# EasyEDA Pro project 电源板.epro

# Schematic Schematic1
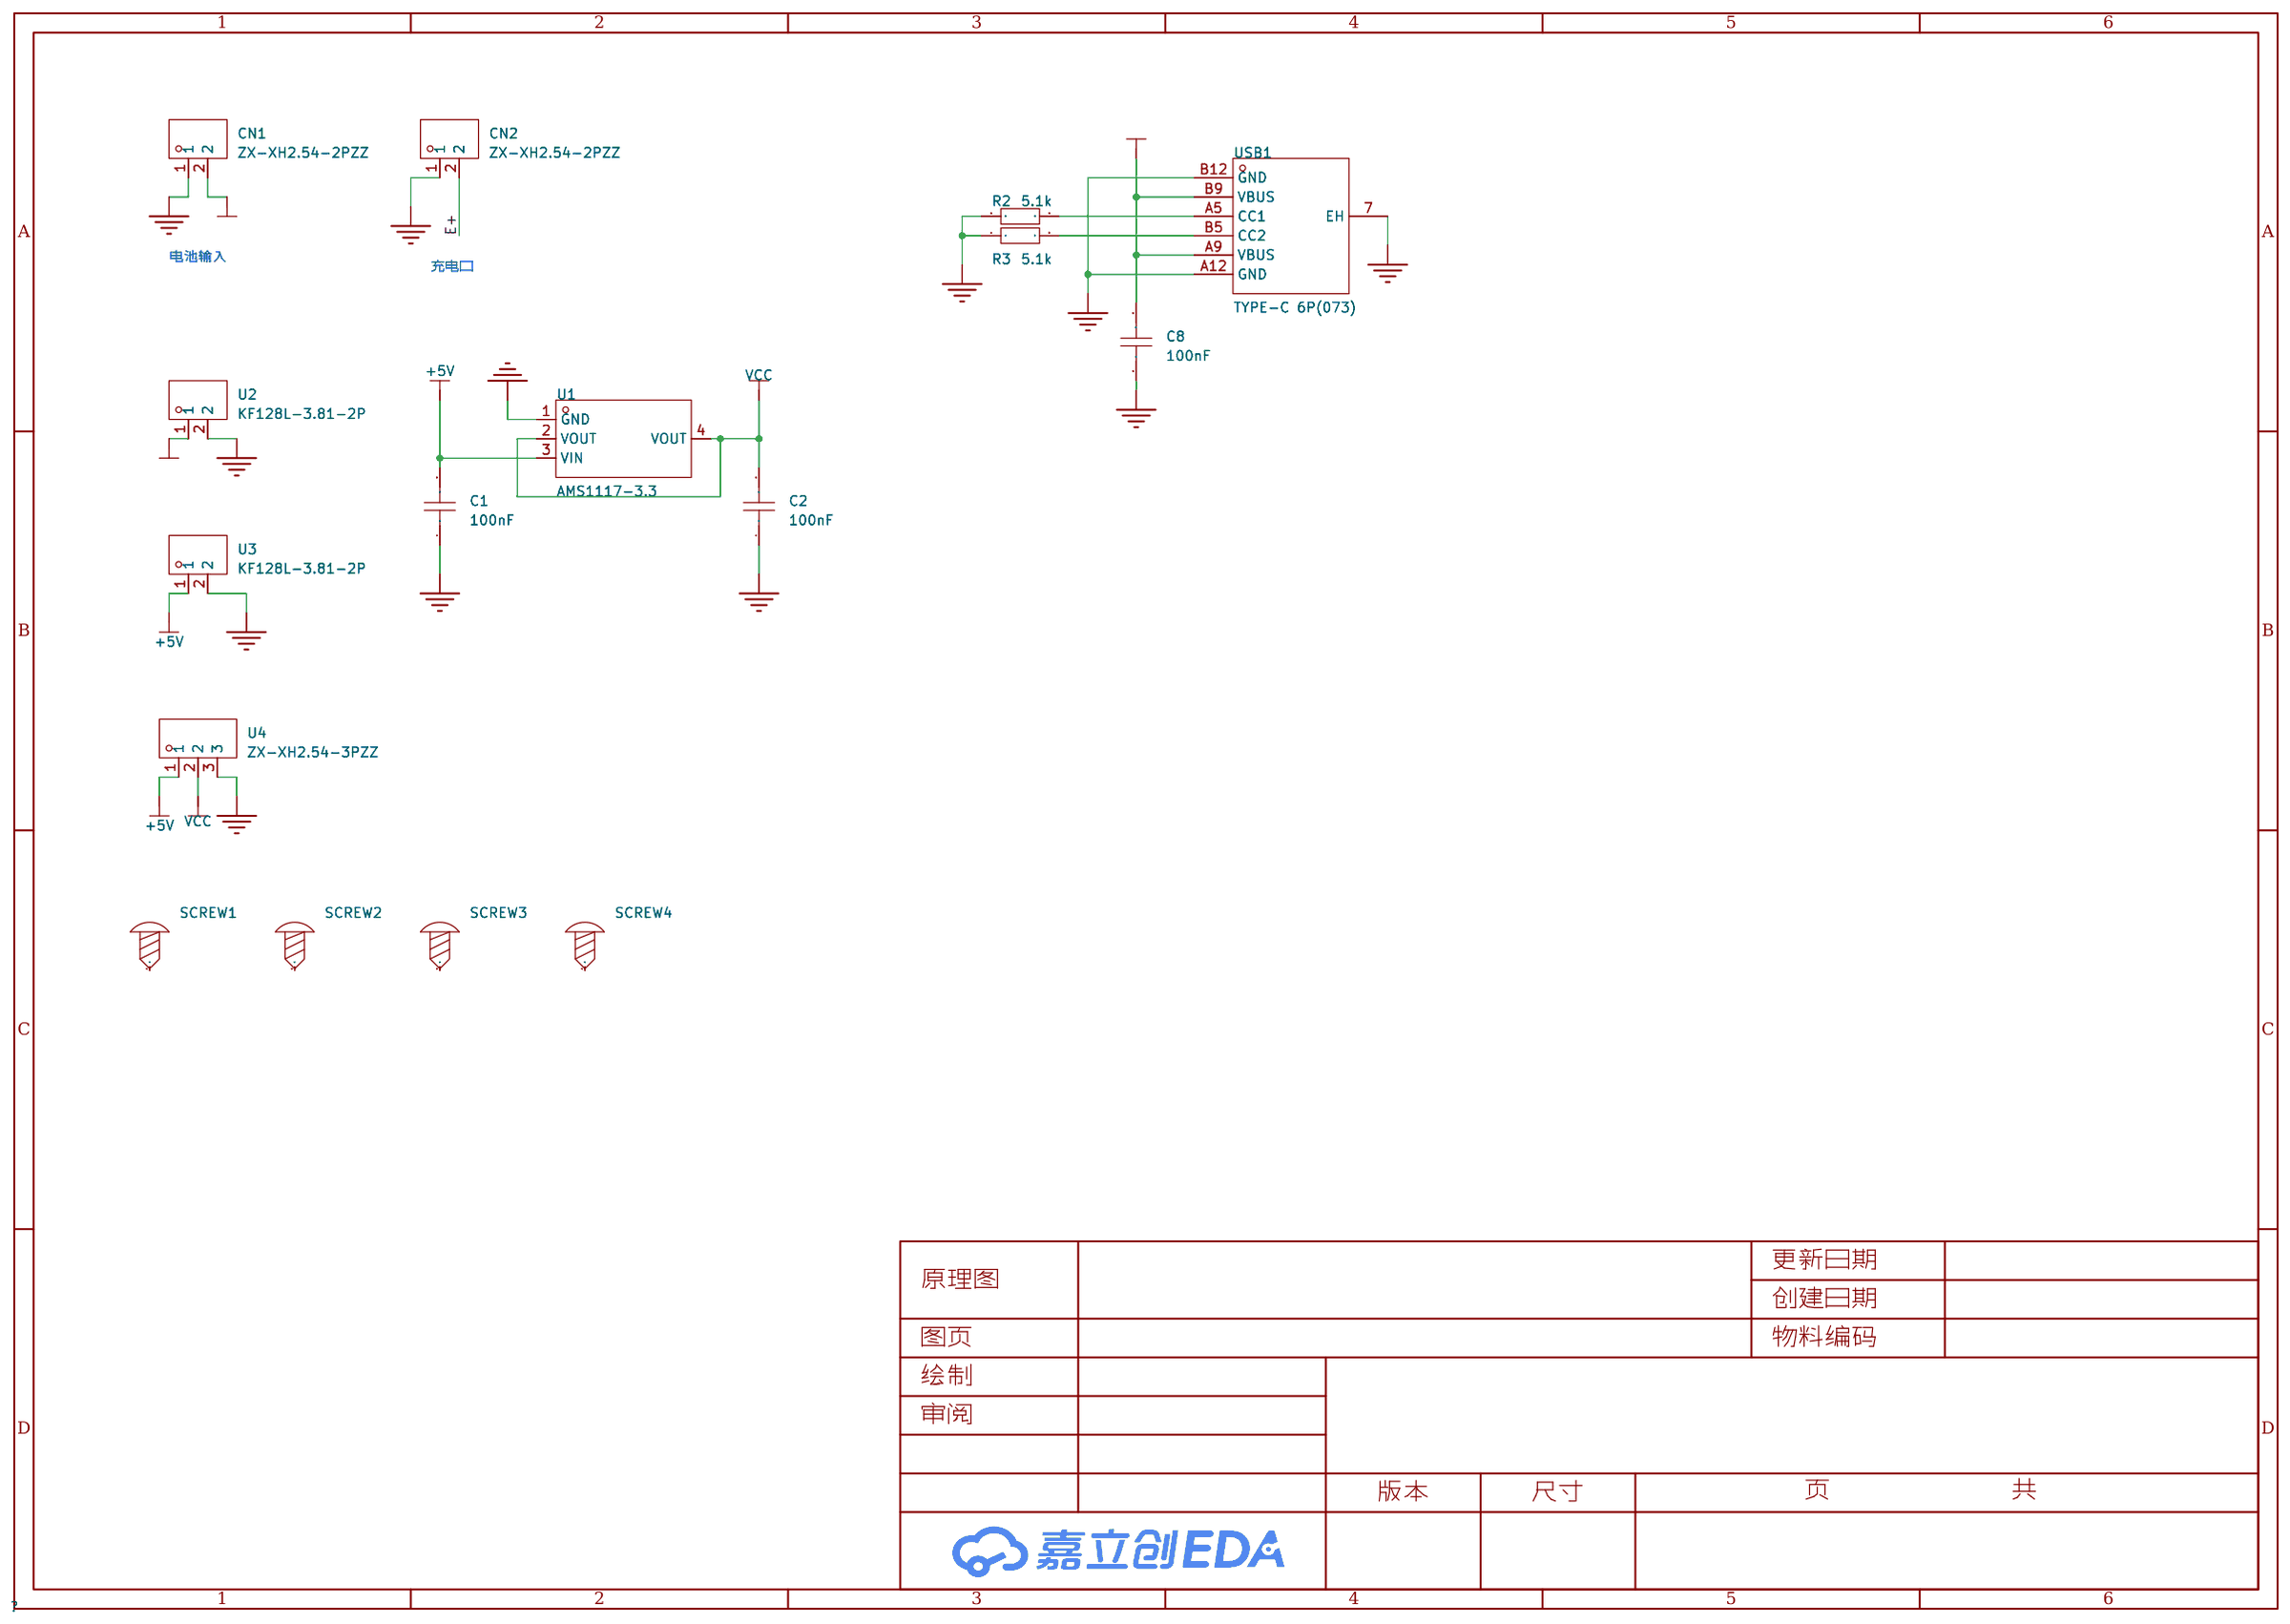
[diagram p0: schematic sheet]

## Parts
C1  100nF  [C0603]
C2  100nF  [C0603]
C8  100nF  [C0603]
CN1  ZX-XH2.54-2PZZ  [CONN-TH_2P-P2.50_HX25003-2A]
CN2  ZX-XH2.54-2PZZ  [CONN-TH_2P-P2.50_HX25003-2A]
R2  5.1k  [R0603]
R3  5.1k  [R0603]
SCREW1  -  [M3螺丝]
SCREW2  -  [M3螺丝]
SCREW3  -  [M3螺丝]
SCREW4  -  [M3螺丝]
U1  AMS1117-3.3  [SOT-223-3_L6.5-W3.4-P2.30-LS7.0-BR]
U2  KF128L-3.81-2P  [CONN-TH_P3.81_KF128L-3.81-2P]
U3  KF128L-3.81-2P  [CONN-TH_P3.81_KF128L-3.81-2P]
U4  ZX-XH2.54-3PZZ  [CONN-TH_3P-P2.54_2501S-3P]
USB1  TYPE-C 6P(073)  [TYPE-C-SMD_TYPE-C-6P_5]

## Library data of the parts
C1 C2 C8 = CAP_0603: Supplier Footprint: 0603
CN1 CN2 = ZX-XH2.54-2PZZ: 插针结构:1x2P;间距:2.54mm;安装方式:直插;参考系列:XH;总PIN数:2P;排数:1;每排PIN数:2;行距:-;额定电流:3A;触头材质:黄铜;触头镀层:锡;工作温度范围:-25℃~+85℃;; Supplier Part: C7429632; Manufacturer: Megastar(兆星); Supplier Footprint: 插件,P=2.54mm; JLCPCB Part Class: 扩展库; Datasheet: https://atta.szlcsc.com/upload/public/pdf/source/20230619/19BA6947230AA44A04D3EDD65E618FD0.pdf; Supplier: LCSC; Pins Structure: 1x2P; Pitch: 2.54mm; Mounting Style: 直插; Reference Series: XH; Number of Pins: 2P; Number of Rows: 1; Number of PINs Per Row: 2; Current Rating (Max): 3A; Contact Material: 黄铜; Contact Plating: 锡; Operating Temperature Range: -25℃~+85℃
R2 R3 = Res_0603: Supplier Footprint: 0603
SCREW1-SCREW4 = M3螺丝: Supplier Footprint: 插件
U1 = AMS1117-3.3_C6186: 输出类型:固定;最大输入电压:-;输出电压:3.3V;最大输出电流:1A;电源纹波抑制比(PSRR):72dB@(120Hz);输出极性:正极;; LCSC Part Name: 输出3.3V 1A; Supplier Part: C6186; Manufacturer: AMS; Supplier Footprint: SOT-223; JLCPCB Part Class: 基础库; Datasheet: https://atta.szlcsc.com/upload/public/pdf/source/20180727/C6186_7A095716F0823C02F1997A905E26C086.pdf; Supplier: LCSC; Output Type: 固定; Output Voltage: 3.3V; MAX Output Current: 1A; Power Supply Rejection Ratio (PSRR): 72dB@(120Hz); Dropout Voltage: 1.3V@(800mA); Output Polarity: 正极; Number of Outputs: 1
U2 U3 = KF128L-3.81-2P: 结构:1x2P;间距:3.81mm;颜色:绿色;安装方式:直插;额定电流:10A;额定电压:300V;排数:1;线规 - AWG:16~26;线规 - 平方毫米:1;每排PIN数:2;工作温度范围:-40℃~+105℃;; LCSC Part Name: 3.81mm 1x2P 排数:1 每排P数:2 直插; Supplier Part: C474932; Manufacturer: KEFA(科发); Supplier Footprint: 插件,P=3.81mm; JLCPCB Part Class: 扩展库; Datasheet: https://atta.szlcsc.com/upload/public/pdf/source/20240118/B0177BAB216696F90B0D16B51EF273F7.pdf; Supplier: LCSC; Structure: 1x2P; Pitch: 3.81mm; Color: 绿色; Mounting Style: 直插; Current Rating (Max): 10A; Voltage Rating (Max): 300V; Number of Pins: 2P; Number of Rows: 1; Wire Gauge - AWG: 16~26; Wire Gauge - mm2: 1; Number of PINs Per Row: 2; Operating Temperature Range: -40℃~+105℃
U4 = ZX-XH2.54-3PZZ: 插针结构:1x3P;间距:2.54mm;安装方式:直插;参考系列:XH;总PIN数:3P;排数:1;每排PIN数:3;行距:-;额定电流:3A;触头材质:黄铜;触头镀层:锡;工作温度范围:-25℃~+85℃;; Supplier Part: C7429633; Manufacturer: Megastar(兆星); Supplier Footprint: 插件,P=2.54mm; JLCPCB Part Class: 扩展库; Datasheet: https://atta.szlcsc.com/upload/public/pdf/source/20230619/AE17037A2CFDBE8D9CBA775D61AD0A84.pdf; Supplier: LCSC; Pins Structure: 1x3P; Pitch: 2.54mm; Mounting Style: 直插; Reference Series: XH; Number of Pins: 3P; Number of Rows: 1; Number of PINs Per Row: 3; Current Rating (Max): 3A; Contact Material: 黄铜; Contact Plating: 锡; Operating Temperature Range: -25℃~+85℃
USB1 = TYPE-C 6P(073): 连接器类型:Type-C;标准:-;公母:母;端口数量:1;触点数量:6P;安装方式:卧贴;额定电流 - 电源:5A;工作温度范围:-25℃~+85℃;; LCSC Part Name: Type-C 母 卧贴; Supplier Part: C668623; Manufacturer: SHOU HAN(首韩); Supplier Footprint: SMD; JLCPCB Part Class: 扩展库; Datasheet: https://atta.szlcsc.com/upload/public/pdf/source/20200618/C668623_A4B260DED7AC1949BAC6AE39E9F4CD80.pdf; Supplier: LCSC; Connector Type: Type-C; Gender: 母; Number of Ports: 1; Number of Contacts: 6P; Mounting Style: 卧贴; Current Rating - Power (Max): 5A; Operating Temperature Range: -25℃~+85℃

## Nets
+5V: C1.2 U1.3(VIN) U3.1 U4.1
+7.4V: CN1.2 U2.1
GND: C1.1 C2.1 C8.1 CN1.1 CN2.1 R2.1 R3.1 U1.1(GND) U2.2 U3.2 U4.3 USB1.7(EH) USB1.A12(GND) USB1.B12(GND)
VCC: C2.2 U1.2(VOUT) U1.4(VOUT) U4.2
E+: C8.2 CN2.2 USB1.A9(VBUS) USB1.B9(VBUS)
$1N2605: R3.2 USB1.B5(CC2)
$1N2608: R2.2 USB1.A5(CC1)

Not connected (* = marked no-connect by the designer): SCREW1 1; SCREW2 1; SCREW3 1; SCREW4 1

## Notes on the sheet
- 电池输入
- 充电口

# Board PCB1
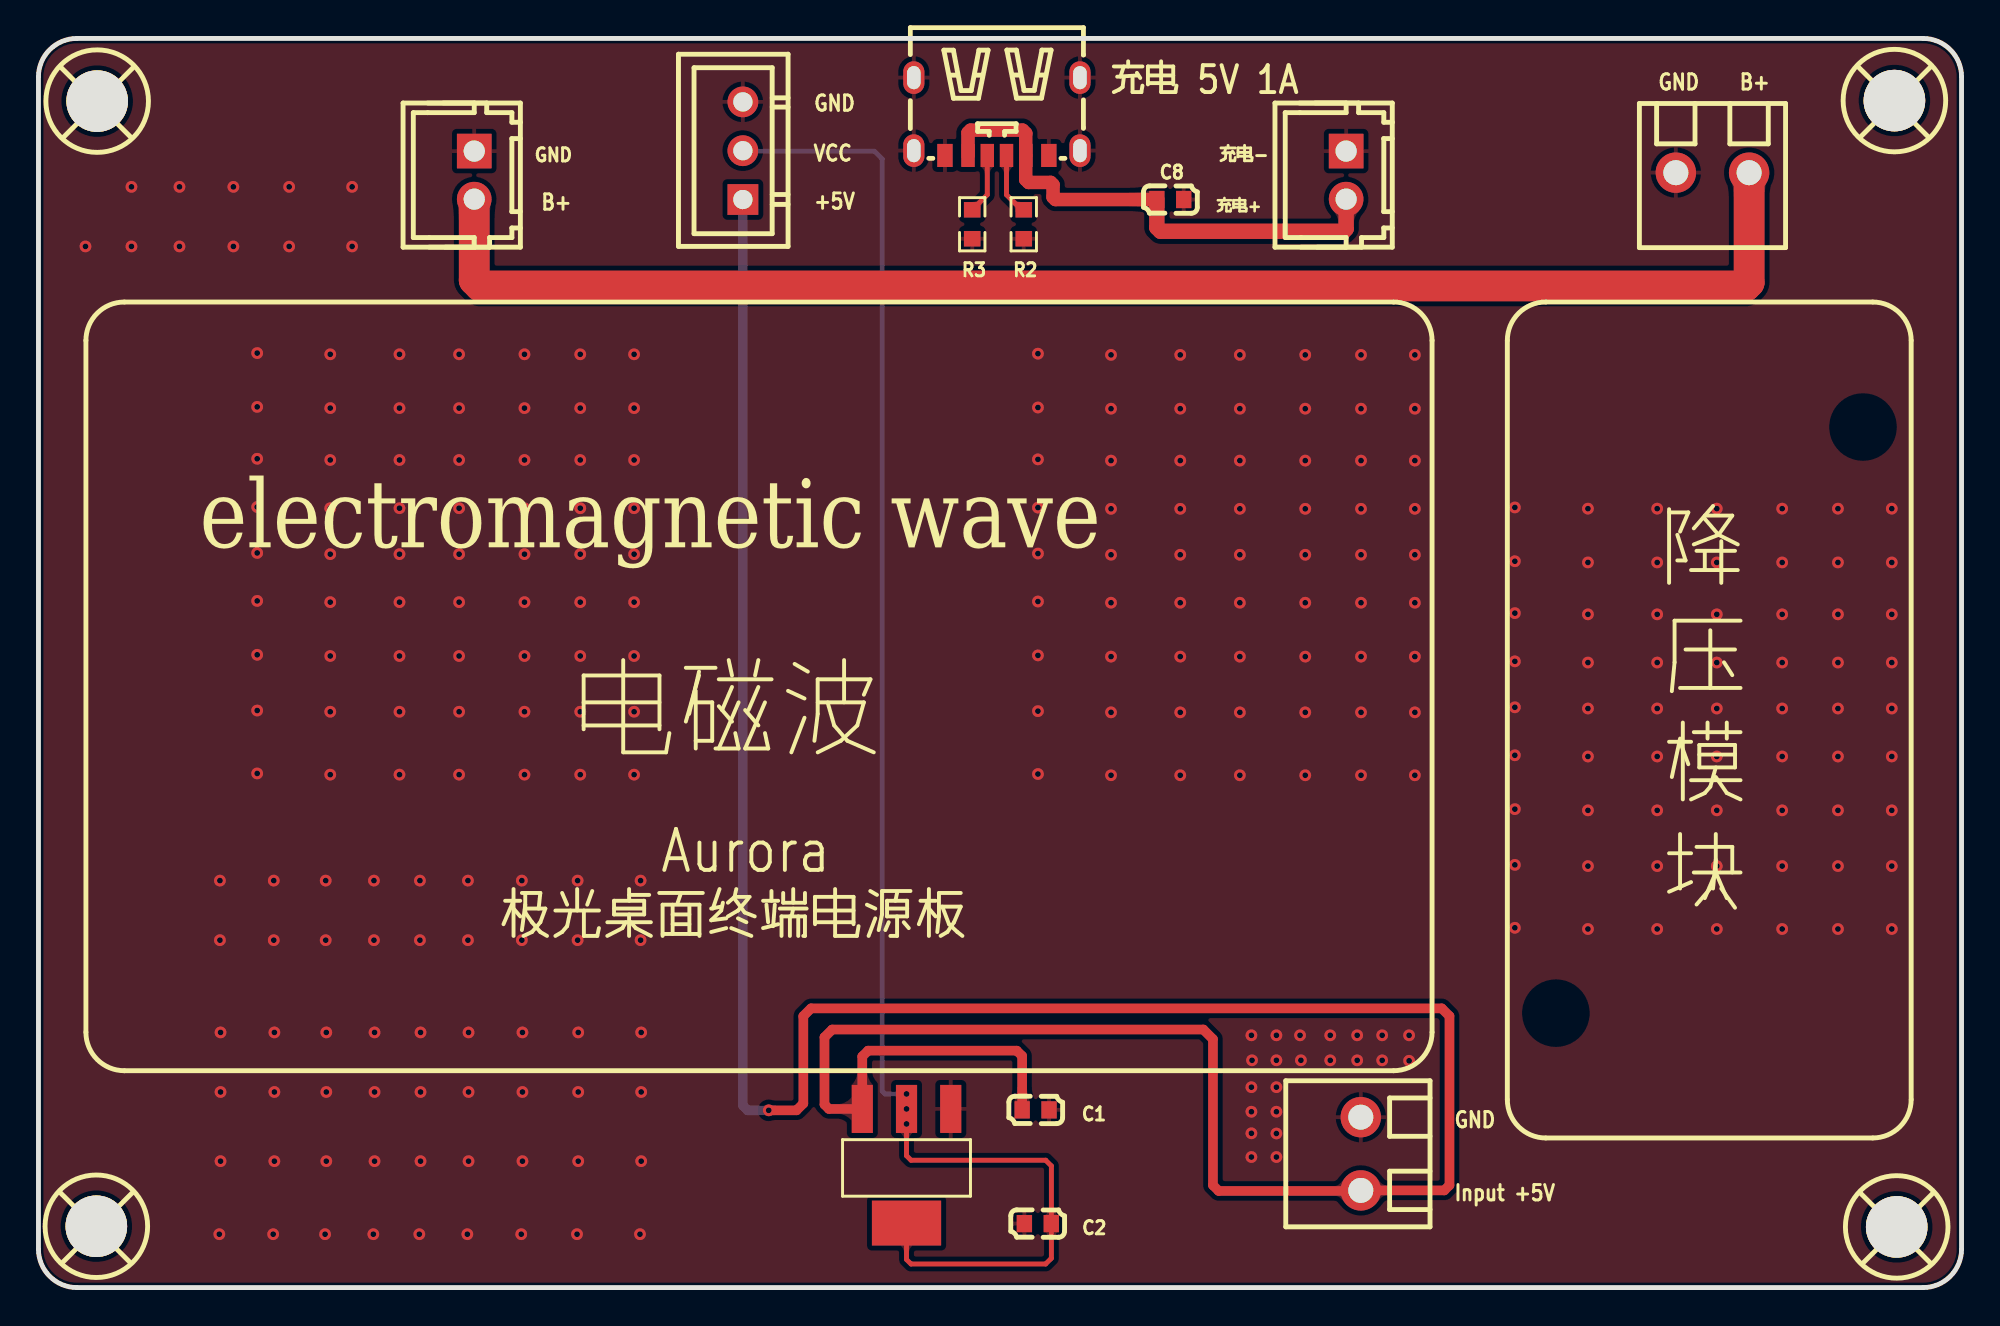
[diagram p1: board, top side]
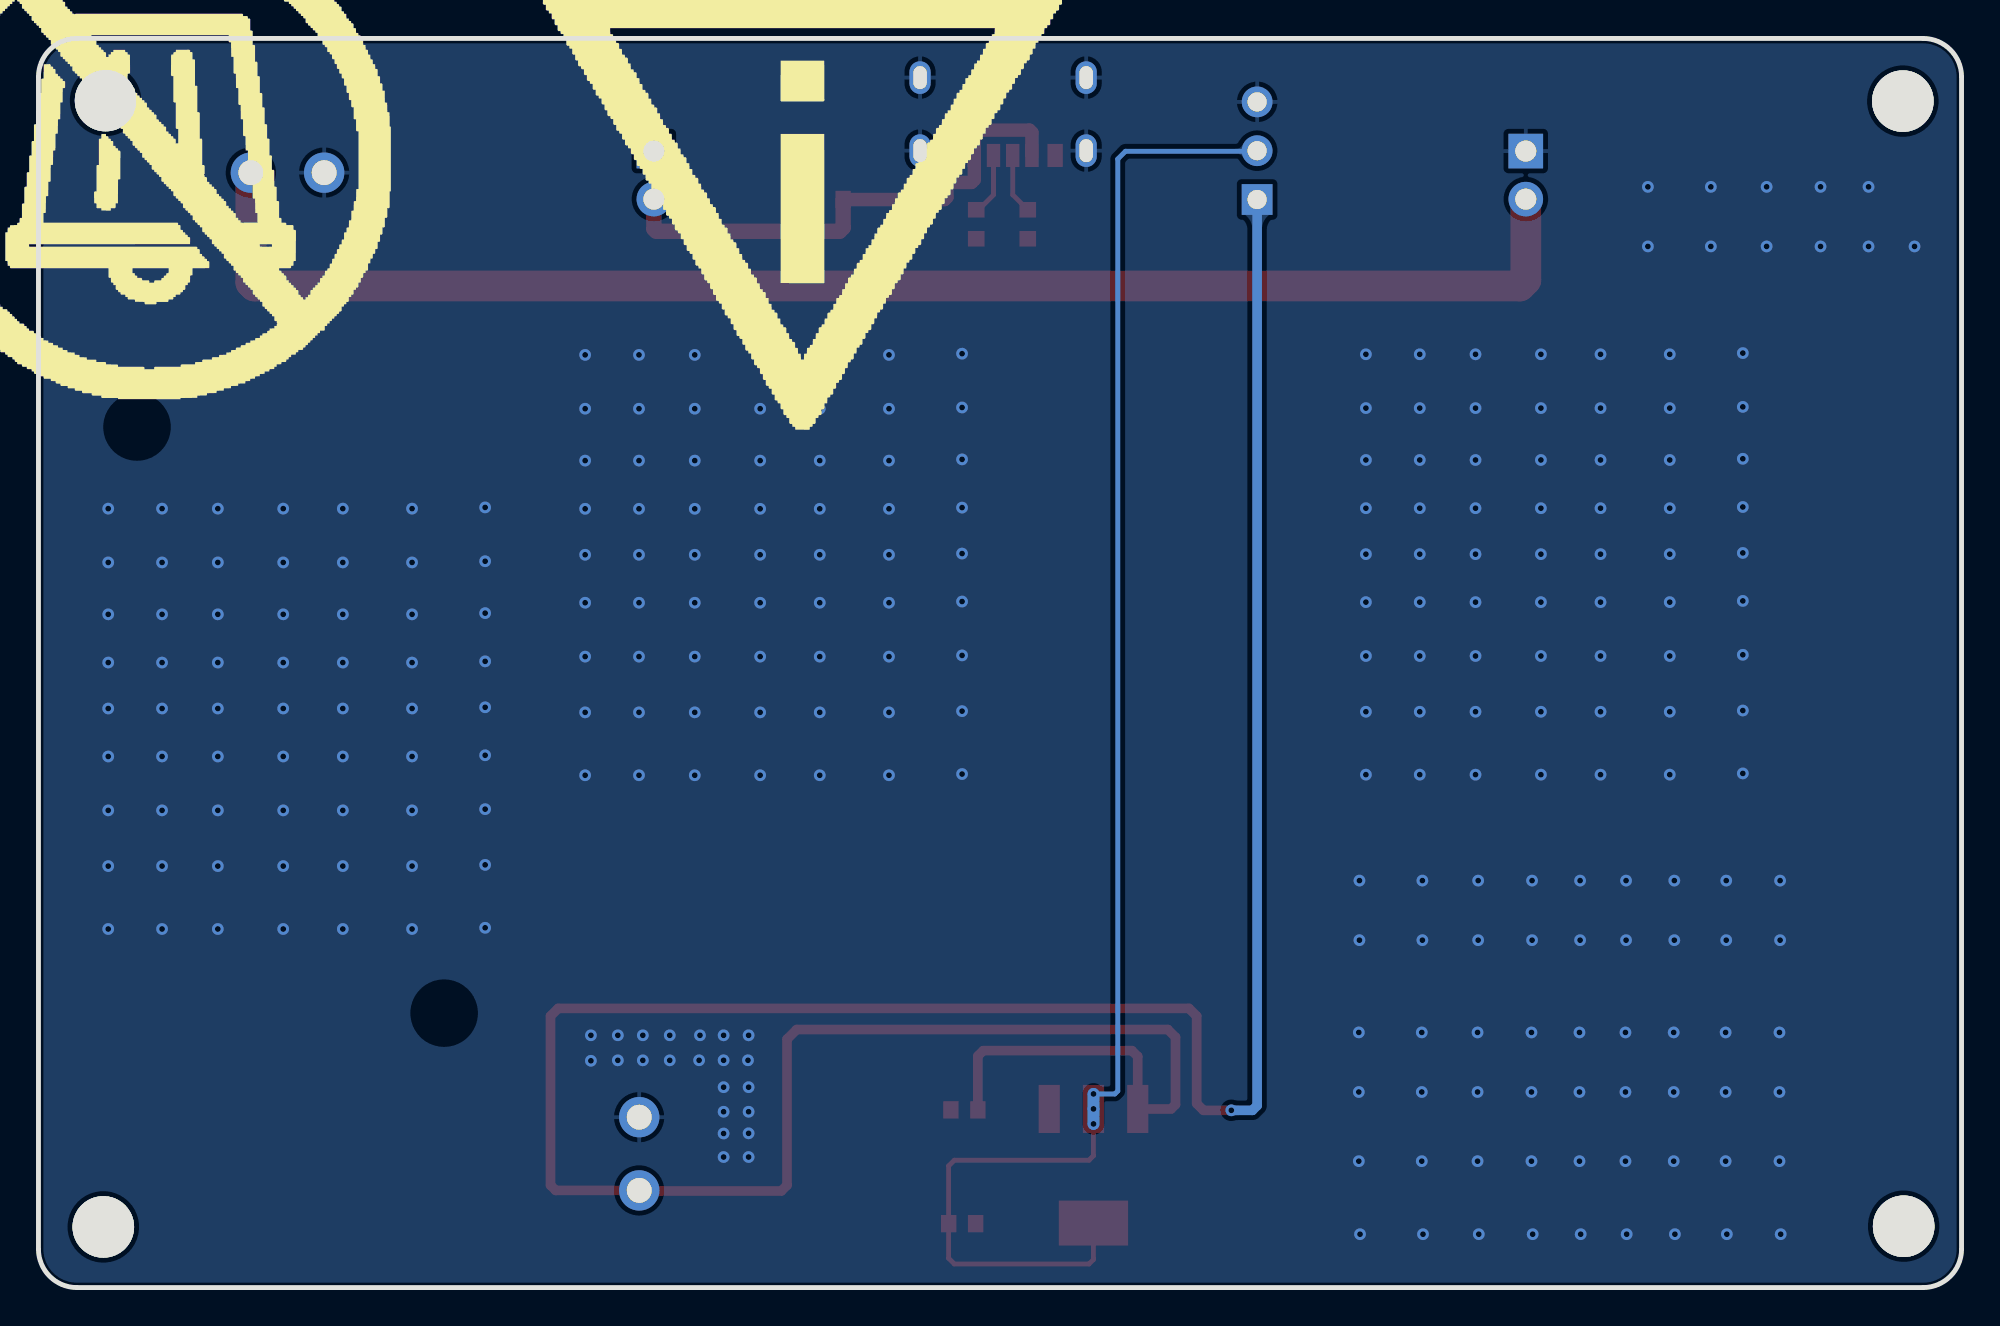
[diagram p2: board, bottom side, seen from below]

Outline 100 x 65 mm; copper layers: Top Layer, Bottom Layer. Coordinates in mm from the lower left corner of the outline.
Outline path: 0,63 0,2 arc(0.59,0.59) 2,0 98,0 arc(99.41,0.59) 100,2 100,63 arc(99.41,64.41) 98,65 2,65 arc(0.59,64.41) 0,63
Stack: Top Layer 0.035mm / Dielectric1 1.51mm FR4 er 4.5 / Bottom Layer 0.035mm

## Design rules (mm)
template: JLCPCB Capability(Two Layers Board)
spacing copperThickness1oz (default): track to track 0.102, other pairs 0.152 to 0.3
spacing copperThickness2oz: track to track 0.203, other pairs 0.152 to 0.3
track width copperThickness1oz (default): min 0.127, default 0.254, max 2.54
track width copperThickness2oz: min 0.203, default 0.254, max 2.54
differential pair differentialPair (default): width min 0.127, default 0.254, max 2.54; gap min 0.152, default 0.152
via viaSize (default): diameter min 0.5, default 0.61, max 10; hole min 0.3, default 0.305, max 6.3

## Placement (name value [footprint] x y rotation side)
C1  100nF  [C0603]  51.85 9.25 180 top
C2  100nF  [C0603]  51.97 3.33 0 top
C8  100nF  [C0603]  58.85 56.62 180 top
GND  ZX-XH2.54-2PZZ  [CONN-TH_2P-P2.50_HX25003-2A]  22.66 57.89 270 top
R2  5.1k  [R0603]  51.24 55.33 90 top
R3  5.1k  [R0603]  48.56 55.33 90 top
SCREW1  -  [M3螺丝]  96.57 61.7 0 top
SCREW2  -  [M3螺丝]  3.12 61.67 0 top
SCREW3  -  [M3螺丝]  3.07 3.13 0 top
SCREW4  -  [M3螺丝]  96.69 3.09 0 top
U1  AMS1117-3.3  [SOT-223-3_L6.5-W3.4-P2.30-LS7.0-BR]  45.14 6.33 90 top
U2  KF128L-3.81-2P  [CONN-TH_P3.81_KF128L-3.81-2P]  87.05 58.02 180 top
U3  KF128L-3.81-2P  [CONN-TH_P3.81_KF128L-3.81-2P]  68.76 6.96 90 top
U4  ZX-XH2.54-3PZZ  [CONN-TH_3P-P2.54_2501S-3P]  36.63 59.16 90 top
USB1  TYPE-C 6P(073)  [TYPE-C-SMD_TYPE-C-6P_5]  49.84 60.94 180 top
充电+  ZX-XH2.54-2PZZ  [CONN-TH_2P-P2.50_HX25003-2A]  68 57.89 270 top

## Footprints (pads in the part's own frame, mm; a bottom-side part is the same pattern mirrored in y, then rotated)
C0603
  rect 0.8x0.9 smd: 1(-0.7,0) 2(0.7,0)
CONN-TH_2P-P2.50_HX25003-2A
  rect 1.8x1.8 hole 1.1: 1(-1.25,0)
  round 1.8 hole 1.1: 2(1.25,0)
CONN-TH_3P-P2.54_2501S-3P
  rect 1.6x1.6 hole 1: 1(-2.54,0)
  round 1.6 hole 1: 2(0,0) 3(2.54,0)
CONN-TH_P3.81_KF128L-3.81-2P
  round 2.1 hole 1.3: 1(-1.905,0) 2(1.905,0)
M3螺丝
  round 3.2 hole 3.2: 1(-0.064,0.064)
R0603
  rect 0.806x0.864 smd: 1(-0.753,0) 2(0.753,0)
SOT-223-3_L6.5-W3.4-P2.30-LS7.0-BR
  rect 2.5x1.1 smd: 1(2.97,-2.3) 2(2.97,0) 3(2.97,2.3)
  rect 2.34x3.6 smd: 4(-2.97,0)
TYPE-C-SMD_TYPE-C-6P_5
  oval 1.1x1.7 hole 0.7x1.2: 7(-4.32,1.775) 7(-4.32,-2.025) 7(4.32,1.775) 7(4.32,-2.025)
  rect 0.7x1.2 smd: A5(-0.5,2.025) A9(1.5,2.025) B5(0.5,2.025) B9(-1.5,2.025)
  rect 0.8x1.2 smd: A12(2.7,2.025) B12(-2.7,2.025)

## Nets
+5V: C1.2 U1.3 U3.1 U4.1
+7.4V: GND.2 U2.1
GND: C1.1 C2.1 C8.1 GND.1 R2.1 R3.1 U1.1 U2.2 U3.2 U4.3 USB1.7 USB1.A12 USB1.B12 充电+.1
VCC: C2.2 U1.2 U1.4 U4.2
E+: C8.2 USB1.A9 USB1.B9 充电+.2
$1N2605: R3.2 USB1.B5
$1N2608: R2.2 USB1.A5

Pads without a net: SCREW1 1; SCREW2 1; SCREW3 1; SCREW4 1

## Via types
v1: diameter 0.61, hole 0.305, Top Layer to Bottom Layer, 280 vias

## Routing (per net, layer and track width the routed paths; a pad name or vN(x,y) marks a point on that pad's centre or on a via; arc(x,y) is an arc through that point)
+5V: length 158.2
  Top Layer w0.5: v1(37.97,9.22) 39.42,9.22 39.77,9.58 39.77,14.13 40.17,14.53 72.97,14.53 73.37,14.13 73.37,5.33 73.1,5.06 U3.1 68.73,5.03 61.37,5.03 61.07,5.33 61.07,12.93 60.57,13.43 41.27,13.43 40.87,13.03 40.87,9.53 41.1,9.3 42.84,9.3 42.84,12.03 43.14,12.33 50.87,12.33 51.15,12.05 C1.2
  Bottom Layer w0.5: v1(37.97,9.22) 36.88,9.22 36.63,9.47 U4.1
+7.4V: length 76.4
  Top Layer w1.6: GND.2 22.66,52.43 22.97,52.12 88.77,52.12 88.95,52.3 U2.1
GND:
  vias: v1(2.45,54.18) v1(4.84,57.28) v1(4.84,54.18) v1(7.33,57.28) v1(7.33,54.18) v1(9.4,2.78) v1(9.44,21.18) v1(9.44,18.08) v1(9.47,13.28) v1(9.47,10.18) v1(9.47,6.58) v1(10.14,57.28) v1(10.14,54.18) v1(11.37,48.63) v1(11.37,45.83) v1(11.37,43.13) v1(11.37,40.62) v1(11.37,38.23) v1(11.37,35.73) v1(11.37,32.93) v1(11.37,30.03) v1(11.37,26.75) v1(12.2,2.78) v1(12.24,21.18) v1(12.24,18.08) v1(12.27,13.28) v1(12.27,10.18) v1(12.27,6.58) v1(13.04,57.28) v1(13.04,54.18) v1(14.9,2.78) v1(14.94,21.18) v1(14.94,18.08) v1(14.97,13.28) v1(14.97,10.18) v1(14.97,6.58) v1(15.17,48.56) v1(15.17,45.76) v1(15.17,43.06) v1(15.17,40.56) v1(15.17,38.16) v1(15.17,35.67) v1(15.17,32.86) v1(15.17,29.96) v1(15.17,26.69) v1(16.31,57.28) v1(16.31,54.18) v1(17.41,2.78) v1(17.45,21.18) v1(17.45,18.08) v1(17.48,13.28) v1(17.48,10.18) v1(17.48,6.58) v1(18.77,48.56) v1(18.77,45.76) v1(18.77,43.06) v1(18.77,40.56) v1(18.77,38.16) v1(18.77,35.67) v1(18.77,32.86) v1(18.77,29.96) v1(18.77,26.69) v1(19.8,2.78) v1(19.84,21.18) v1(19.84,18.08) v1(19.87,13.28) v1(19.87,10.18) v1(19.87,6.58) v1(21.87,48.56) v1(21.87,45.76) v1(21.87,43.06) v1(21.87,40.56) v1(21.87,38.16) v1(21.87,35.67) v1(21.87,32.86) v1(21.87,29.96) v1(21.87,26.69) v1(22.3,2.78) v1(22.33,21.18) v1(22.33,18.08) v1(22.36,13.28) v1(22.36,10.18) v1(22.36,6.58) v1(25.1,2.78) v1(25.14,21.18) v1(25.14,18.08) v1(25.17,13.28) v1(25.17,10.18) v1(25.17,6.58) v1(25.27,48.56) v1(25.27,45.76) v1(25.27,43.06) v1(25.27,40.56) v1(25.27,38.16) v1(25.27,35.67) v1(25.27,32.86) v1(25.27,29.96) v1(25.27,26.69) v1(28,2.78) v1(28.04,21.18) v1(28.04,18.08) v1(28.07,13.28) v1(28.07,10.18) v1(28.07,6.58) v1(28.17,48.56) v1(28.17,45.76) v1(28.17,43.06) v1(28.17,40.56) v1(28.17,38.16) v1(28.17,35.67) v1(28.17,32.86) v1(28.17,29.96) v1(28.17,26.69) v1(30.97,48.56) v1(30.97,45.76) v1(30.97,43.06) v1(30.97,40.56) v1(30.97,38.16) v1(30.97,35.67) v1(30.97,32.86) v1(30.97,29.96) v1(30.97,26.69) v1(31.31,21.18) v1(31.31,18.08) v1(31.28,2.78) v1(31.34,13.28) v1(31.34,10.18) v1(31.34,6.58) v1(51.97,48.6) v1(51.97,45.8) v1(51.97,43.1) v1(51.97,40.59) v1(51.97,38.2) v1(51.97,35.7) v1(51.97,32.9) v1(51.97,30) v1(51.97,26.72) v1(55.77,48.53) v1(55.77,45.73) v1(55.77,43.03) v1(55.77,40.52) v1(55.77,38.13) v1(55.77,35.64) v1(55.77,32.83) v1(55.77,29.93) v1(55.77,26.66) v1(59.37,48.53) v1(59.37,45.73) v1(59.37,43.03) v1(59.37,40.52) v1(59.37,38.13) v1(59.37,35.64) v1(59.37,32.83) v1(59.37,29.93) v1(59.37,26.66) v1(62.47,48.53) v1(62.47,45.73) v1(62.47,43.03) v1(62.47,40.52) v1(62.47,38.13) v1(62.47,35.64) v1(62.47,32.83) v1(62.47,29.93) v1(62.47,26.66) v1(63.07,13.13) v1(63.11,11.83) v1(63.07,10.43) v1(63.07,9.15) v1(63.07,8.03) v1(63.07,6.79) v1(64.37,13.13) v1(64.37,11.83) v1(64.37,10.43) v1(64.37,9.15) v1(64.37,8.02) v1(64.37,6.79) v1(65.6,13.13) v1(65.65,11.83) v1(65.87,48.53) v1(65.87,45.73) v1(65.87,43.03) v1(65.87,40.52) v1(65.87,38.13) v1(65.87,35.64) v1(65.87,32.83) v1(65.87,29.93) v1(65.87,26.66) v1(67.17,13.13) v1(67.17,11.82) v1(68.57,13.13) v1(68.57,11.82) v1(68.77,48.53) v1(68.77,45.73) v1(68.77,43.03) v1(68.77,40.52) v1(68.77,38.13) v1(68.77,35.64) v1(68.77,32.83) v1(68.77,29.93) v1(68.77,26.66) v1(69.87,13.13) v1(69.87,11.82) v1(71.27,13.13) v1(71.27,11.8) v1(71.57,48.53) v1(71.57,45.73) v1(71.57,43.03) v1(71.57,40.52) v1(71.57,38.13) v1(71.57,35.64) v1(71.57,32.83) v1(71.57,29.93) v1(71.57,26.66) v1(76.77,40.6) v1(76.77,37.8) v1(76.77,35.1) v1(76.77,32.59) v1(76.77,30.2) v1(76.77,27.7) v1(76.77,24.9) v1(76.77,22) v1(76.77,18.72) v1(80.57,40.53) v1(80.57,37.73) v1(80.57,35.03) v1(80.57,32.52) v1(80.57,30.13) v1(80.57,27.64) v1(80.57,24.83) v1(80.57,21.93) v1(80.57,18.66) v1(84.17,40.53) v1(84.17,37.73) v1(84.17,35.03) v1(84.17,32.52) v1(84.17,30.13) v1(84.17,27.64) v1(84.17,24.83) v1(84.17,21.93) v1(84.17,18.66) v1(87.27,40.53) v1(87.27,37.73) v1(87.27,35.03) v1(87.27,32.52) v1(87.27,30.13) v1(87.27,27.64) v1(87.27,24.83) v1(87.27,21.93) v1(87.27,18.66) v1(90.67,40.53) v1(90.67,37.73) v1(90.67,35.03) v1(90.67,32.52) v1(90.67,30.13) v1(90.67,27.64) v1(90.67,24.83) v1(90.67,21.93) v1(90.67,18.66) v1(93.57,40.53) v1(93.57,37.73) v1(93.57,35.03) v1(93.57,32.52) v1(93.57,30.13) v1(93.57,27.64) v1(93.57,24.83) v1(93.57,21.93) v1(93.57,18.66) v1(96.37,40.53) v1(96.37,37.73) v1(96.37,35.03) v1(96.37,32.52) v1(96.37,30.13) v1(96.37,27.64) v1(96.37,24.83) v1(96.37,21.93) v1(96.37,18.66)
VCC: length 83.5
  Top Layer w0.254: U1.4 45.14,1.46 45.37,1.23 52.37,1.23 52.67,1.53 52.67,3.32 C2.2 52.67,3.33 52.67,6.33 52.37,6.63 45.37,6.63 45.14,6.86 v1(45.14,8.51) v1(45.14,9.3)
  Bottom Layer w0.254: v1(45.14,10.08) 44.03,10.08 43.88,10.23 43.88,58.72 43.47,59.13 36.66,59.13 U4.2
  Bottom Layer w0.61: v1(45.14,8.51) v1(45.14,9.3) v1(45.14,10.08)
E+: length 27.3
  Top Layer w0.7: C8.2 52.89,56.62 52.76,56.75 52.76,57.38 52.63,57.51 51.49,57.51 51.34,57.66 USB1.B9 51.34,60.06 51.17,60.23 48.47,60.23 48.34,60.09 USB1.A9
  Top Layer w0.8: C8.2 58.16,55.16 58.35,54.97 67.87,54.97 68,55.09 充电+.2
$1N2605: length 3.2
  Top Layer w0.254: 48.56,56.08 49.34,56.87 USB1.B5
$1N2608: length 3.3
  Top Layer w0.254: 51.24,56.08 51.12,56.08 50.34,56.86 USB1.A5

## Copper pours and planes (outline as drawn; the poured copper is in the pictures)
GND on Top Layer: -3.53,68.43 104.67,68.43 104.67,-4.67 -3.53,-4.67
GND on Bottom Layer: -1.73,66.33 101.77,66.33 101.77,-2.07 -1.73,-2.07

Small or netless copper shapes (teardrops, artwork), in the pictures only: 19 on Top Layer, 8 on Bottom Layer

## Text on the board
Top Silkscreen Layer: VCC | GND | +5V | Input +5V | B+ | Aurora / 极光桌面终端电源板 | electromagnetic wave | 电磁波 | 充电 5V 1A | 降 / 压 / 模 / 块 | 充电-
